# Altium project SYNCBOX_V3I1.PrjPcb (part 4 of 5)

## Sheet [07] - CPU CONNECTORS .SchDoc
size A2; Organization: Altium Limited; Address1: L3, 12a Rodborough Rd; Address2: Frenchs Forest; Address3: NSW; Address4: Australia 2086; DocumentNumber: 7; SheetNumber: 7; SheetTotal: 11
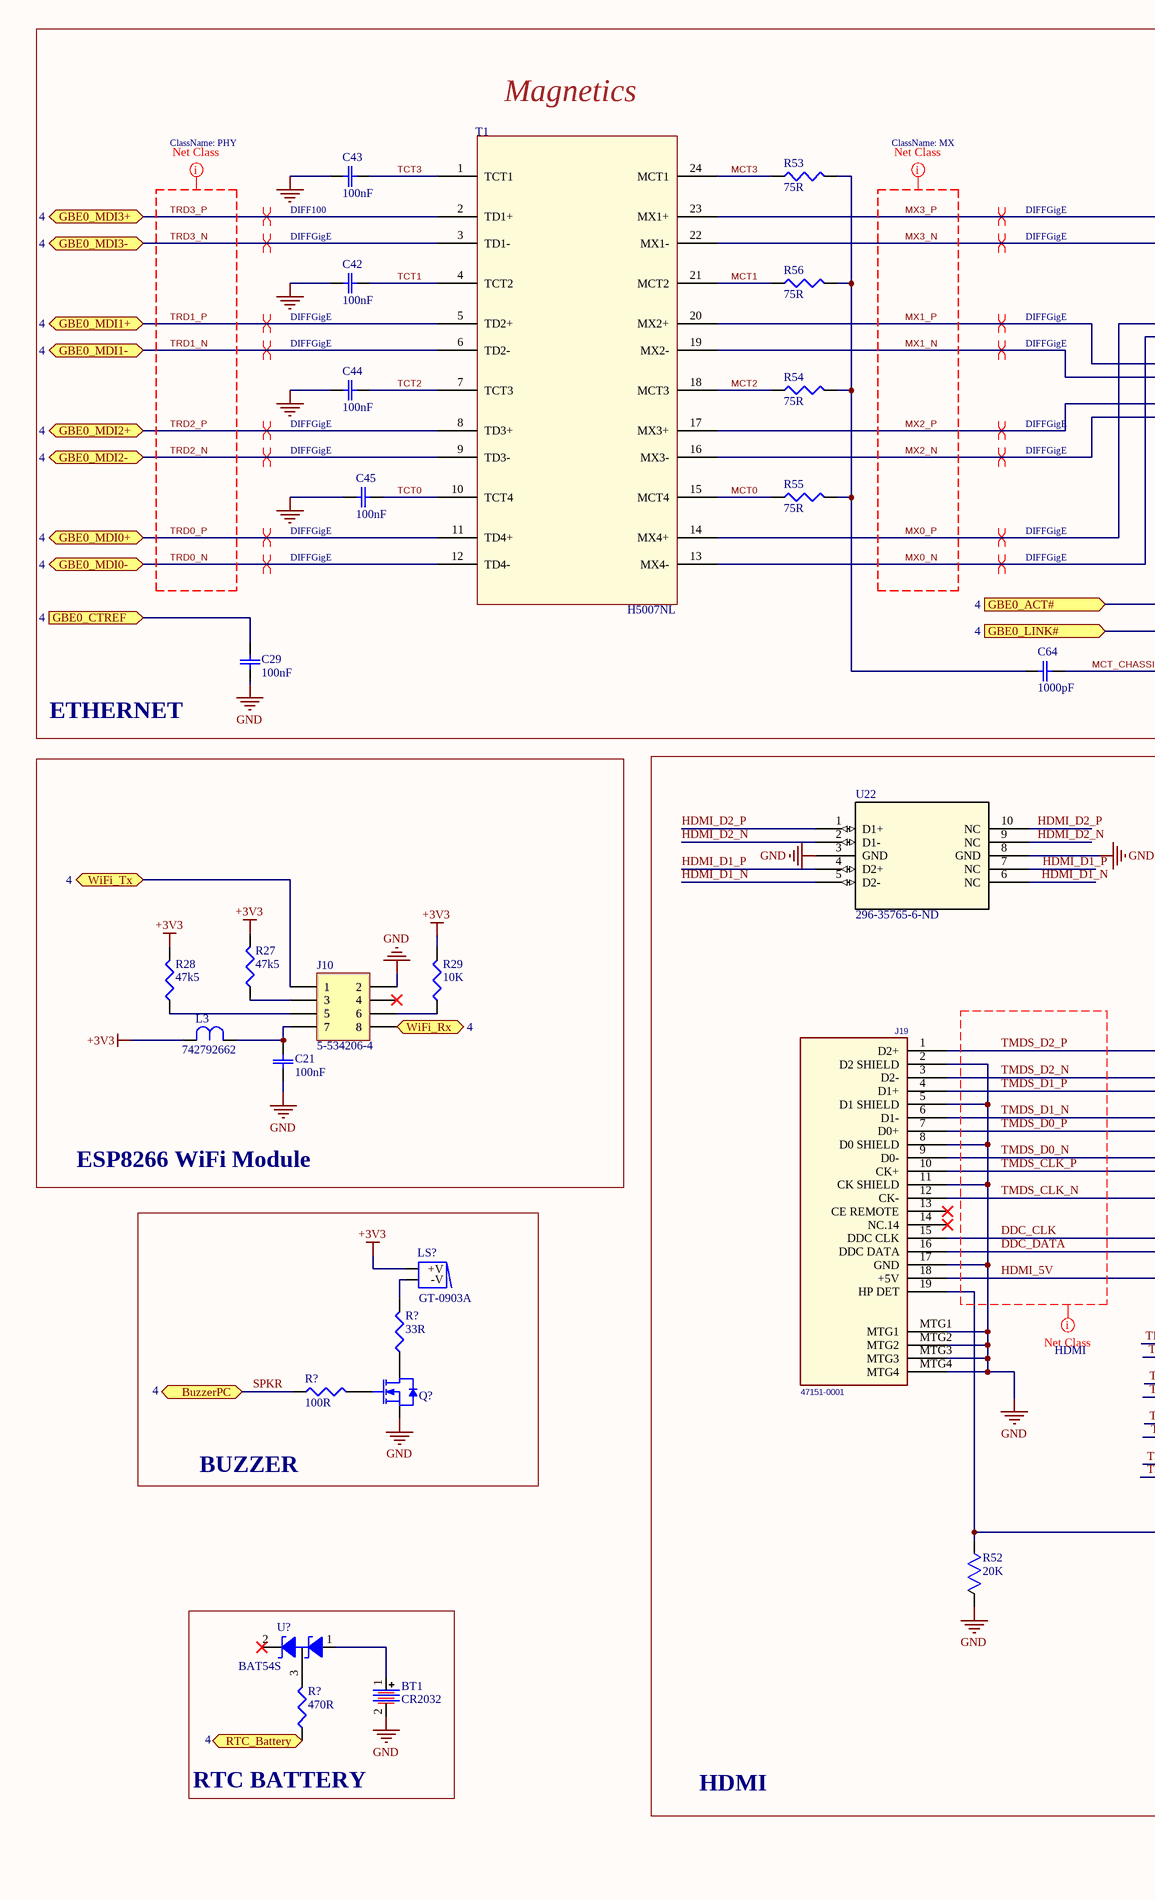
[diagram p10: [07] - CPU CONNECTORS .SchDoc, left]
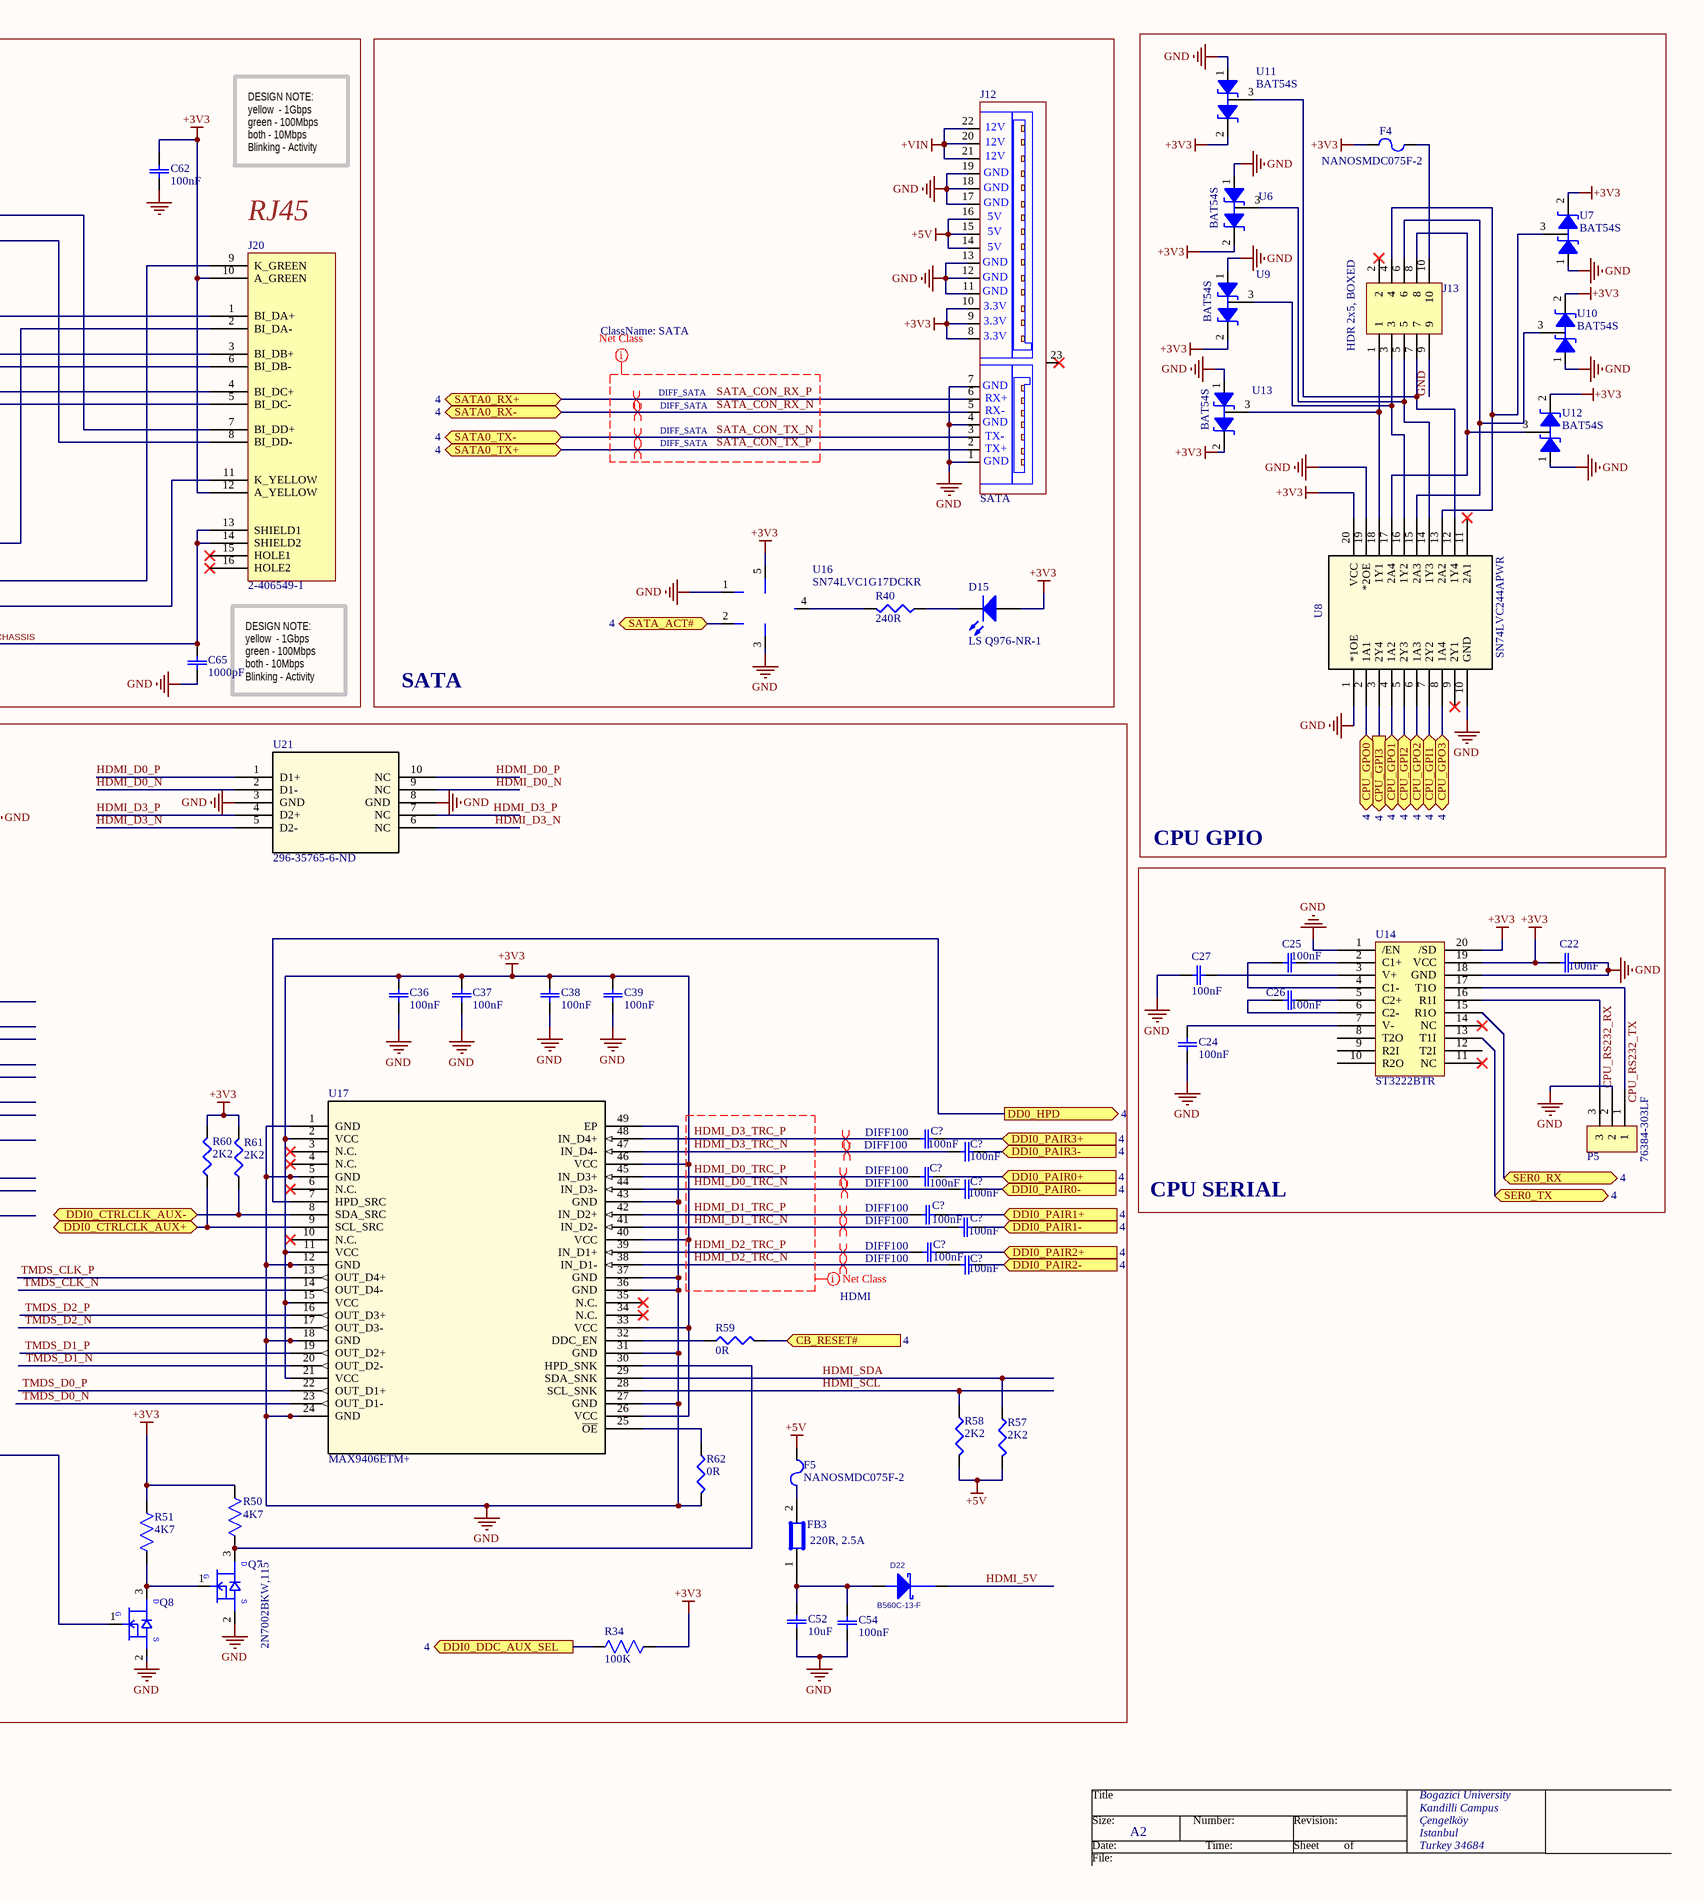
[diagram p11: [07] - CPU CONNECTORS .SchDoc, right]

### Parts
(Parts that share a designator on the sheet are numbered #1, #2 ... from top to bottom, then left to right.)
BT1  CR2032  [BS-7]
C21  100nF  [C0402]
C22  100nF  [C0402]
C24  100nF  [C0402]
C25  100nF  [C0402]
C26  100nF  [C0402]
C27  100nF  [C0402]
C29  100nF  [C0402]
C36  100nF  [C0402]
C37  100nF  [C0402]
C38  100nF  [C0402]
C39  100nF  [C0402]
C42  100nF  [C0402]
C43  100nF  [C0402]
C44  100nF  [C0402]
C45  100nF  [C0402]
C52  10uF  [CAP_3216]
C54  100nF  [C0402]
C62  100nF  [C0402]
C64  1000pF  [C1206]
C65  1000pF  [C1206]
C?#16  100nF  [CAP_1608]
C?#17  100nF  [CAP_1608]
C?#18  100nF  [CAP_1608]
C?#19  100nF  [CAP_1608]
C?#20  100nF  [CAP_1608]
C?#21  100nF  [CAP_1608]
C?#22  100nF  [CAP_1608]
C?#23  100nF  [CAP_1608]
D15  LS Q976-NR-1  [D0603_Directional]
D22  B560C-13-F  [SMC]
F4  NANOSMDC075F-2  [FUS_NANO_TYCO]
F5  NANOSMDC075F-2  [FUS_NANO_TYCO]
FB3  220R, 2.5A  [C0603]
J10  5-534206-4  [ESP8266_WSOC]
J12  SATA  [SATA_Recepticle]
J13  HDR 2x5, BOXED  [HDR_2X5_2.54MM_BOXED]
J19  47151-0001  [HDMI]
J20  2-406549-1  [RJ45LED]
L3  742792662  [IND_1608-M]
LS?  GT-0903A  [GT-0903A]
P5  76384-303LF  [HDR_1X3_2.54MM_SHDR_V2]
Q7  2N7002BKW,115  [SC70_SOT323]
Q8  2N7002BKW,115  [SC70_SOT323]  (value not drawn)
Q?  MOSFET N-CH 20V 1A SOT323  [SC70_SOT323]  (value not drawn)
R27  47k5  [R0402]
R28  47k5  [R0402]
R29  10K  [R0402]
R34  100K  [STA_RNCP0805-M]
R40  240R  [R0402]
R50  4K7  [RES0805_CRG_TYCO]
R51  4K7  [RES0805_CRG_TYCO]
R52  20K  [STA_RNCP0805]
R53  75R  [R0402]
R54  75R  [R0402]
R55  75R  [R0402]
R56  75R  [R0402]
R57  2K2  [R0402]
R58  2K2  [R0402]
R59  0R  [R0402]
R60  2K2  [R0402]
R61  2K2  [R0402]
R62  0R  [R0402]
R?#1  33R  [R0402]
R?#2  100R  [R0402]
R?#3  470R  [R0402]
T1  H5007NL  [H5007NL]
U6  BAT54S  [SOT-23]
U7  BAT54S  [SOT-23]
U8  SN74LVC244APWR  [PW20]
U9  BAT54S  [SOT-23]
U10  BAT54S  [SOT-23]
U11  BAT54S  [SOT-23]
U12  BAT54S  [SOT-23]
U13  BAT54S  [SOT-23]
U14  ST3222BTR  [TSSOP20]
U16  SN74LVC1G17DCKR  [DCK5]
U17  MAX9406ETM+  [21-0144H_T4877-6]
U21  296-35765-6-ND  [DQA10]
U22  296-35765-6-ND  [DQA10]
U?#4  BAT54S  [SOT-23]

### Blocks framed on the sheet
SATA: D15 J12 R40 U16
CPU GPIO: F4 J13 U6-U13
ESP8266 WiFi Module: C21 J10 L3 R27-R29
HDMI: C36-C39 C52 C54 C?#16-C?#23 D22 F5 FB3 J19 Q7 Q8 R34 R50-R52 R57-R62 U17 U21 U22
BUZZER: LS? Q? R?#1 R?#2
RTC BATTERY: BT1 R?#3 U?#4

### Ports
BuzzerPC (bidir, see 4), CB_RESET# (in, see 4), CPU_GPI1 (bidir, see 4), CPU_GPI2 (bidir, see 4), CPU_GPI3 (out, see 4), CPU_GPO0 (bidir, see 4), CPU_GPO1 (bidir, see 4), CPU_GPO2 (bidir, see 4), CPU_GPO3 (bidir, see 4), DD0_HPD (out, see 4), DDI0_CTRLCLK_AUX+ (bidir), DDI0_CTRLCLK_AUX- (bidir), DDI0_DDC_AUX_SEL (out, see 4), DDI0_PAIR0+ (in, see 4), DDI0_PAIR0- (in, see 4), DDI0_PAIR1+ (in, see 4), DDI0_PAIR1- (in, see 4), DDI0_PAIR2+ (in, see 4), DDI0_PAIR2- (in, see 4), DDI0_PAIR3+ (in, see 4), DDI0_PAIR3- (in, see 4), GBE0_ACT# (in, see 4), GBE0_CTREF (in, see 4), GBE0_LINK# (in, see 4), GBE0_MDI0+ (bidir, see 4), GBE0_MDI0- (bidir, see 4), GBE0_MDI1+ (bidir, see 4), GBE0_MDI1- (bidir, see 4), GBE0_MDI2+ (bidir, see 4), GBE0_MDI2- (bidir, see 4), GBE0_MDI3+ (bidir, see 4), GBE0_MDI3- (bidir, see 4), RTC_Battery (bidir, see 4), SATA0_RX+ (bidir, see 4), SATA0_RX- (bidir, see 4), SATA0_TX+ (bidir, see 4), SATA0_TX- (bidir, see 4), SATA_ACT# (bidir, see 4), SER0_RX (bidir, see 4), SER0_TX (bidir, see 4), WiFi_Rx (bidir, see 4), WiFi_Tx (bidir, see 4)

### Nets
+3V3: C22.2 C36.2 C37.2 C38.2 C39.2 C62.2 D15.1(A) F4.2 J12.8 J12.9 J12.10 J20.10(A_GREEN) J20.12(A_YELLOW) L3.2 LS?.1(+V) R27.2 R28.2 R29.2 R34.1 R50.1 R51.1 R60.2 R61.2 U6.2 U7.2 U8.20(VCC) U9.2 U10.2 U11.2 U12.2 U13.2 U14.19(VCC) U14.20(/SD) U16.5(VCC) U17.2(VCC) U17.11(VCC) U17.15(VCC) U17.21(VCC) U17.26(VCC) U17.33(VCC) U17.40(VCC) U17.46(VCC)  [project net PWR_OUT2]
+5V: F5.2 J12.14 J12.15 J12.16 R57.2 R58.2
+VIN: J12.20 J12.21 J12.22
GND: BT1.2 C21.1 C22.1 C24.1 C27.1 C29.1 C36.1 C37.1 C38.1 C39.1 C42.1 C43.1 C44.1 C45.1 C52.1 C54.1 C62.1 C65.2 J10.2 J12.1 J12.4 J12.7 J12.11 J12.12 J12.13 J12.17 J12.18 J12.19 J13.9 J19.2(D2_SHIELD) J19.5(D1_SHIELD) J19.8(D0_SHIELD) J19.11(CK_SHIELD) J19.17(GND) J19.MTG1 J19.MTG2 J19.MTG3 J19.MTG4 P5.2 Q7.2(SOURCE) Q8.2(SOURCE) Q?.2(S) R52.2 R62.2 U6.1 U7.1 U8.1(*1OE) U8.10(GND) U8.19(*2OE) U9.1 U10.1 U11.1 U12.1 U13.1 U14.1(/EN) U14.18(GND) U16.1(NC) U16.3(GND) U17.1(GND) U17.5(GND) U17.12(GND) U17.18(GND) U17.24(GND) U17.27(GND) U17.31(GND) U17.36(GND) U17.37(GND) U17.43(GND) U17.49(EP) U21.3(GND) U21.8(GND) U22.3(GND) U22.8(GND)
CPU_GPO0: U8.2(1A1) ; port CPU_GPO0
CPU_RS232_RX: P5.3 U14.16(R1I)
CPU_RS232_TX: P5.1 U14.17(T1O)
DDC_CLK: J19.15(DDC_CLK)
DDC_DATA: J19.16(DDC_DATA)
HDMI_5V: D22.1(cathode) J19.18(+5V)
HDMI_D0_N: U21.2(D1-) U21.9(NC)
HDMI_D0_P: U21.1(D1+) U21.10(NC)
HDMI_D0_TRC_N: C?#19.1 U17.44(IN_D3-)
HDMI_D0_TRC_P: C?#18.1 U17.45(IN_D3+)
HDMI_D1_N: U22.5(D2-) U22.6(NC)
HDMI_D1_P: U22.4(D2+) U22.7(NC)
HDMI_D1_TRC_N: C?#21.1 U17.41(IN_D2-)
HDMI_D1_TRC_P: C?#20.1 U17.42(IN_D2+)
HDMI_D2_N: U22.2(D1-) U22.9(NC)
HDMI_D2_P: U22.1(D1+) U22.10(NC)
HDMI_D2_TRC_N: C?#23.1 U17.38(IN_D1-)
HDMI_D2_TRC_P: C?#22.1 U17.39(IN_D1+)
HDMI_D3_N: U21.5(D2-) U21.6(NC)
HDMI_D3_P: U21.4(D2+) U21.7(NC)
HDMI_D3_TRC_N: C?#17.1 U17.47(IN_D4-)
HDMI_D3_TRC_P: C?#16.1 U17.48(IN_D4+)
HDMI_SCL: R58.1 U17.28(SCL_SNK)
HDMI_SDA: R57.1 U17.29(SDA_SNK)
MCT0: R55.1 T1.15(MCT4)
MCT1: R56.1 T1.21(MCT2)
MCT2: R54.1 T1.18(MCT3)
MCT3: R53.1 T1.24(MCT1)
MCT_CHASSIS: C64.1 C65.1 J20.13(SHIELD1) J20.14(SHIELD2)
MX0_N: J20.2(BI_DA-) T1.13(MX4-)
MX0_P: J20.1(BI_DA+) T1.14(MX4+)
MX1_N: J20.6(BI_DB-) T1.19(MX2-)
MX1_P: J20.3(BI_DB+) T1.20(MX2+)
MX2_N: J20.5(BI_DC-) T1.16(MX3-)
MX2_P: J20.4(BI_DC+) T1.17(MX3+)
MX3_N: J20.8(BI_DD-) T1.22(MX1-)
MX3_P: J20.7(BI_DD+) T1.23(MX1+)
SATA_CON_RX_N: J12.5 ; port SATA0_RX-
SATA_CON_RX_P: J12.6 ; port SATA0_RX+
SATA_CON_TX_N: J12.3 ; port SATA0_TX-
SATA_CON_TX_P: J12.2 ; port SATA0_TX+
SPKR: R?#2.1 ; port BuzzerPC
TCT0: C45.2 T1.10(TCT4)
TCT1: C42.2 T1.4(TCT2)
TCT2: C44.2 T1.7(TCT3)
TCT3: C43.2 T1.1(TCT1)
TMDS_CLK_N: J19.12(CK-) U17.14(OUT_D4-)
TMDS_CLK_P: J19.10(CK+) U17.13(OUT_D4+)
TMDS_D0_N: J19.9(D0-) U17.23(OUT_D1-)
TMDS_D0_P: J19.7(D0+) U17.22(OUT_D1+)
TMDS_D1_N: J19.6(D1-) U17.20(OUT_D2-)
TMDS_D1_P: J19.4(D1+) U17.19(OUT_D2+)
TMDS_D2_N: J19.3(D2-) U17.17(OUT_D3-)
TMDS_D2_P: J19.1(D2+) U17.16(OUT_D3+)
TRD0_N: T1.12(TD4-) ; port GBE0_MDI0-
TRD0_P: T1.11(TD4+) ; port GBE0_MDI0+
TRD1_N: T1.6(TD2-) ; port GBE0_MDI1-
TRD1_P: T1.5(TD2+) ; port GBE0_MDI1+
TRD2_N: T1.9(TD3-) ; port GBE0_MDI2-
TRD2_P: T1.8(TD3+) ; port GBE0_MDI2+
TRD3_N: T1.3(TD1-) ; port GBE0_MDI3-
TRD3_P: T1.2(TD1+) ; port GBE0_MDI3+
NetBT1_1: BT1.1 U?#4.1
NetC21_2: C21.2 J10.7 L3.1
NetC24_2: C24.2 U14.7(V-)
NetC25_1: C25.1 U14.2(C1+)
NetC25_2: C25.2 U14.4(C1-)
NetC26_1: C26.1 U14.5(C2+)
NetC26_2: C26.2 U14.6(C2-)
NetC27_2: C27.2 U14.3(V+)
NetC29_2: C29.2 ; port GBE0_CTREF
NetC52_2: C52.2 C54.2 D22.2(ANODE) FB3.1
NetC64_2: C64.2 R53.2 R54.2 R55.2 R56.2
NetC?#16_2: C?#16.2 ; port DDI0_PAIR3+
NetC?#17_2: C?#17.2 ; port DDI0_PAIR3-
NetC?#18_2: C?#18.2 ; port DDI0_PAIR0+
NetC?#19_2: C?#19.2 ; port DDI0_PAIR0-
NetC?#20_2: C?#20.2 ; port DDI0_PAIR1+
NetC?#21_2: C?#21.2 ; port DDI0_PAIR1-
NetC?#22_2: C?#22.2 ; port DDI0_PAIR2+
NetC?#23_2: C?#23.2 ; port DDI0_PAIR2-
NetD15_2: D15.2(K) R40.1
NetF4_1: F4.1 J13.10
NetF5_1: F5.1 FB3.2
NetJ8#1_A8: J20.11(K_YELLOW) ; port GBE0_LINK#
NetJ8#1_A28: U16.2(A) ; port SATA_ACT#
NetJ8#1_A63: U8.7(2Y2) ; port CPU_GPI1
NetJ8#1_A67: U8.5(2Y3) ; port CPU_GPI2
NetJ8#1_A85: U8.3(2Y4) ; port CPU_GPI3
NetJ8#1_B2: J20.9(K_GREEN) ; port GBE0_ACT#
NetJ8#1_B54: U8.4(1A2) ; port CPU_GPO1
NetJ8#1_B57: U8.6(1A3) ; port CPU_GPO2
NetJ8#1_B63: U8.8(1A4) ; port CPU_GPO3
NetJ8#1_B89: U17.7(HPD_SRC) ; port DD0_HPD
NetJ8#1_B95: R34.2 ; port DDI0_DDC_AUX_SEL
NetJ8#1_B98: R60.1 U17.9(SCL_SRC) ; port DDI0_CTRLCLK_AUX+
NetJ8#1_B99: R61.1 U17.8(SDA_SRC) ; port DDI0_CTRLCLK_AUX-
NetJ10_1: J10.1 ; port WiFi_Tx
NetJ10_3: J10.3 R27.1
NetJ10_5: J10.5 R28.1
NetJ10_6: J10.6 R29.1
NetJ10_8: J10.8 ; port WiFi_Rx
NetJ13_1: J13.1 U8.18(1Y1) U13.3
NetJ13_3: J13.3 U8.16(1Y2) U9.3
NetJ13_4: J13.4 U7.3 U8.13(2A2)
NetJ13_5: J13.5 U6.3 U8.14(1Y3)
NetJ13_6: J13.6 U8.15(2A3) U10.3
NetJ13_7: J13.7 U8.12(1Y4) U11.3
NetJ13_8: J13.8 U8.17(2A4) U12.3
NetJ19_19: J19.19(HP_DET) Q8.1(GATE) R52.1
NetJ?#1_2: U14.15(R1O) ; port SER0_RX
NetJ?#4_1: U14.13(T1I) ; port SER0_TX
NetLS?_2: LS?.2(-V) R?#1.2
NetQ7_1: Q7.1(GATE) Q8.3(DRAIN) R51.2
NetQ7_3: Q7.3(DRAIN) R50.2 U17.30(HPD_SNK)
NetQ?_1: Q?.1(G) R?#2.2
NetQ?_3: Q?.3(D) R?#1.1
NetR40_2: R40.2 U16.4(Y)
NetR59_1: R59.1 U17.32(DDC_EN)
NetR59_2: R59.2 ; port CB_RESET#
NetR62_1: R62.1 U17.25(~{OE})
NetR?#3_1: R?#3.1 ; port RTC_Battery
NetR?#3_2: R?#3.2 U?#4.3

Not connected (* = marked no-connect by the designer): J10 4*; J12 23*; J13 2*; J19 13(CE_REMOTE)* 14(NC.14)*; J20 15(HOLE1)* 16(HOLE2)*; U8 9(2Y1)* 11(2A1)*; U14 8(T2O) 9(R2I) 10(R2O) 11(NC)* 12(T2I) 14(NC)*; U17 3(N.C.)* 4(N.C.)* 6(N.C.)* 10(N.C.)* 34(N.C.)* 35(N.C.)*; U?#4 2*

### Layout directives
differential pair; net class DIFF100: HDMI_D0_TRC_N, HDMI_D0_TRC_P, HDMI_D1_TRC_N, HDMI_D1_TRC_P, HDMI_D2_TRC_N, HDMI_D2_TRC_P, HDMI_D3_TRC_N, HDMI_D3_TRC_P, TRD3_P
differential pair; net class DIFFGigE: MX0_N, MX0_P, MX1_N, MX1_P, MX2_N, MX2_P, MX3_N, MX3_P, TRD0_N, TRD0_P, TRD1_N, TRD1_P, TRD2_N, TRD2_P, TRD3_N
net class PHY: TRD0_N, TRD0_P, TRD1_N, TRD1_P, TRD2_N, TRD2_P, TRD3_N, TRD3_P
net class MX: MX0_N, MX0_P, MX1_N, MX1_P, MX2_N, MX2_P, MX3_N, MX3_P
differential pair; net class DIFF_SATA: SATA_CON_RX_N, SATA_CON_RX_P, SATA_CON_TX_N, SATA_CON_TX_P
net class SATA: SATA_CON_RX_N, SATA_CON_RX_P, SATA_CON_TX_N, SATA_CON_TX_P
net class HDMI: DDC_CLK, DDC_DATA, HDMI_5V, HDMI_D0_TRC_N, HDMI_D0_TRC_P, HDMI_D1_TRC_N, HDMI_D1_TRC_P, HDMI_D2_TRC_N, HDMI_D2_TRC_P, HDMI_D3_TRC_N, HDMI_D3_TRC_P, TMDS_CLK_N, TMDS_CLK_P, TMDS_D0_N, TMDS_D0_P, TMDS_D1_N, TMDS_D1_P, TMDS_D2_N, TMDS_D2_P

### Notes on the sheet
- Magnetics
- DESIGN NOTE:
  yellow  - 1Gbps
  green - 100Mbps
  both - 10Mbps
  Blinking - Activity
- (near J20) RJ45
- ETHERNET
- CPU SERIAL
- Title
- Bogazici University
- Size:
- Date:
- File:
- A2
- Number:
- Time:
- Revision:
- Sheet
- of
- Kandilli Campus
- Çengelköy
- Istanbul
- Turkey 34684
- (in symbol 2N7002BKW,115) D; G; S
- (in symbol SATA) 12V; GND; 5V; 3.3V; RX+; RX-; TX-; TX+

### Library data of the parts
BT1 = CR2032: BS-7-ND; Supplier 1: Electro Sonic; Supplier Part Number 1: BS7; Manufacturer Part Number: BS-7
C21 C29 C36-C39 C42-C45 C62 = CL05A104KA5NNNC: CAP CER 0.1UF 50V X8R 0603; Manufacturer 1: Samsung Electro-Mechanics; Tolerance: ±10%; Voltage - Rated: 25V; Temperature Coefficient: X5R; Notification: Current market demand for these product types have resulted in fluctuating and extending lead times. Lead times may differ.; Description 1: CAP CER 0.1UF 25V X5R 0402; Manufacturer Part Number 1: CL05A104KA5NNNC; RoHS: RoHS Compliant; Stock 1: 100000; Pricing 1: 1=0.1, 10=0.04, 100=0.0176, 500=0.0126, 1000=0.0099, 2500=0.009, 5000=0.00828 (USD); Packaging: Digi-Reel®; Part Status: Active; Operating Temperature: -55°C ~ 85°C; Features: -; Ratings: -; Applications: General Purpose; Mounting Type: Surface Mount, MLCC; Package / Case: 0402 (1005 Metric); Size / Dimension: 0.039" L x 0.020" W (1.00mm x 0.50mm); Height - Seated (Max): -; Thickness (Max): 0.022" (0.55mm); Lead Spacing: -; Lead Style: -; Supplier 1: Digi-Key; Supplier Part Number 1: 1276-1043-6-ND; Category: Capacitors; ComponentLink1URL: http://www.samsungsem.com/kr/support/product-search/mlcc/CL05A104KA5NNNC.jsp; ComponentLink1Description: http://www.samsungsem.com/kr/support/product-search/mlcc/CL05A104KA5NNNC.jsp
C22 C24-C27 C54 = CL05A104KA5NNNC: CAP CER 0.1UF 50V X8R 0603; Manufacturer 1: Samsung Electro-Mechanics; Voltage - Rated: 25V; Tolerance: ±10%; Temperature Coefficient: X5R; Notification: Current market demand for these product types have resulted in fluctuating and extending lead times. Lead times may differ.; Description 1: CAP CER 0.1UF 25V X5R 0402; Category: Capacitors; Operating Temperature: -55°C ~ 85°C; Package / Case: 0402 (1005 Metric); Supplier 1: Digi-Key; Supplier Part Number 1: 1276-1043-6-ND; RoHS: RoHS Compliant; Stock 1: 100000; Pricing 1: 1=0.1, 10=0.04, 100=0.0176, 500=0.0126, 1000=0.0099, 2500=0.009, 5000=0.00828 (USD); Mounting Type: Surface Mount, MLCC; Applications: General Purpose; Ratings: -; Size / Dimension: 0.039" L x 0.020" W (1.00mm x 0.50mm); Height - Seated (Max): -; Thickness (Max): 0.022" (0.55mm); Lead Spacing: -; Features: -; Packaging: Digi-Reel®; Lead Style: -; ComponentLink1URL: http://www.samsungsem.com/kr/support/product-search/mlcc/CL05A104KA5NNNC.jsp; ComponentLink1Description: http://www.samsungsem.com/kr/support/product-search/mlcc/CL05A104KA5NNNC.jsp; Manufacturer Part Number 1: CL05A104KA5NNNC; Part Status: Active
C52 = C3216JB1V106K160: CAP CER 10UF 35V JB 1206; Manufacturer_Part_Number: C3216JB1V106K160AB; Manufacturer 1: TDK Corporation; Tolerance: ±10%; Vendor: TDK; Built_By: EMA_UL_Team; Type: DEV; C: Copyright (C) 2015 Accelerated Designs. All rights reserved; Notification: Current market demand for these product types have resulted in fluctuating and extending lead times. Lead times may differ.; Category: Capacitors; Operating Temperature: -25°C ~ 85°C; Package / Case: 1206 (3216 Metric); Value: Value; Voltage - Rated: 35V; Features: Low ESL; Supplier 1: Digi-Key; Supplier Part Number 1: 445-11736-1-ND; RoHS: RoHS Compliant; Stock 1: 5285; Pricing 1: 1=0.92, 10=0.648, 100=0.4269, 500=0.31626, 1000=0.26881 (USD); Temperature Coefficient: JB; Mounting Type: Surface Mount, MLCC; Applications: General Purpose; Ratings: -; Size / Dimension: 0.126" L x 0.063" W (3.20mm x 1.60mm); Height - Seated (Max): -; Thickness (Max): 0.069" (1.75mm); Lead Spacing: -; Packaging: Cut Tape (CT); Lead Style: -; ComponentLink1URL: https://product.tdk.com/info/en/catalog/datasheets/mlcc_commercial_general_en.pdf; ComponentLink1Description: https://product.tdk.com/info/en/catalog/datasheets/mlcc_commercial_general_en.pdf; RefDes: RefDes; Manufacturer Part Number 1: C3216JB1V106K160AB; Part Status: Active; Failure Rate: -; Description 1: CAP CER 10UF 35V JB 1206
C64 C65 = C1206X102KGRACAUTO: CAP CER 1206 1NF 2000V X7R 10% F; Manufacturer 1: KEMET; Voltage - Rated: 2000V (2kV); Category: Capacitors; Operating Temperature: -55°C ~ 125°C; Package / Case: 1206 (3216 Metric); Supplier 1: Digi-Key; Supplier Part Number 1: 399-16730-1-ND; RoHS: RoHS Compliant; Stock 1: 7503; Pricing 1: 1=0.79, 10=0.58, 100=0.3974, 500=0.31464, 1000=0.26496 (USD); Tolerance: ±10%; Temperature Coefficient: X7R; Mounting Type: Surface Mount, MLCC; Applications: Automotive, Boardflex Sensitive; Ratings: AEC-Q200; Size / Dimension: 0.130" L x 0.063" W (3.30mm x 1.60mm); Height - Seated (Max): -; Thickness (Max): 0.073" (1.85mm); Lead Spacing: -; Features: Low ESL, Soft Termination, High Voltage; Packaging: Cut Tape (CT); Lead Style: -; ComponentLink1URL: https://api.kemet.com/component-edge/download/datasheet/C1206X102KGRACAUTO.pdf; ComponentLink1Description: https://api.kemet.com/component-edge/download/datasheet/C1206X102KGRACAUTO.pdf; Manufacturer Part Number 1: C1206X102KGRACAUTO; Part Status: Active; Failure Rate: -; Description 1: CAP CER 1206 1NF 2000V X7R 10% F
C?#16-C?#23 = C1608X8R1H104K08: CAP CER 0.1UF 50V X8R 0603; Manufacturer_Part_Number: C1608X8R1H104K080AB; Manufacturer 1: TDK Corporation; Vendor: TDK; Built_By: EMA_UL_Team; Type: DEV; C: Copyright (C) 2015 Accelerated Designs. All rights reserved; Tolerance: ±10%; Notification: Current market demand for these product types have resulted in fluctuating and extending lead times. Lead times may differ.; .Checked PCB: CHK; RefDes: RefDes; Value: Value; Manufacturer Part Number 1: C1608X8R1H104K080AB; RoHS: RoHS Compliant; Stock 1: 5228; Pricing 1: 1=0.32, 10=0.216, 100=0.1093, 500=0.07476, 1000=0.06613 (USD); Packaging: Cut Tape (CT); Part Status: Active; Voltage - Rated: 50V; Temperature Coefficient: X8R; Operating Temperature: -55°C ~ 150°C; Features: High Temperature; Ratings: -; Applications: General Purpose; Failure Rate: -; Mounting Type: Surface Mount, MLCC; Package / Case: 0603 (1608 Metric); Size / Dimension: 0.063" L x 0.032" W (1.60mm x 0.80mm); Height - Seated (Max): -; Thickness (Max): 0.035" (0.90mm); Lead Spacing: -; Lead Style: -; Supplier 1: Digi-Key; Supplier Part Number 1: 445-8818-1-ND; Description 1: CAP CER 0.1UF 50V X8R 0603; Category: Capacitors; .Checked SCH: CHK
D15 = LS Q976-NR-1: LED RED DIFFUSED 0603 SMD; Manufacturer 1: OSRAM Opto Semiconductors Inc.; Lens Color: White; Millicandela Rating: 104mcd; Lens Style/Size: Rectangle with Flat Top, 1.00mm x 0.80mm; Voltage - Forward (Vf) (Typ): 2V; Current - Test: 20mA; Viewing Angle: 160°; Wavelength - Dominant: 633nm; Wavelength - Peak: 645nm; Published: 8-Jun-2000; LatestRevisionDate: 08-Jul-2005; LatestRevisionNote: Mech Layer 1 removed.; PackageReference: LED-0; Publisher: Altium Limited; PackageDescription: LED; 2 Leads; Supplier 1: Digi-Key; Supplier Part Number 1: 475-2512-1-ND; Manufacturer Part Number 1: LS Q976-NR-1; RoHS: RoHS Compliant; Description 1: LED RED DIFFUSED 0603 SMD; Category: Optoelectronics; Stock 1: 127302; Pricing 1: 1=0.38, 10=0.274, 25=0.202, 100=0.1444, 250=0.0982, 500=0.08664, 1000=0.06787 (USD); Packaging: Cut Tape (CT); Part Status: Active; Color: Red; Lens Transparency: Diffused; Mounting Type: Surface Mount; Features: -; Package / Case: 0603 (1608 Metric); Supplier Device Package: 0603; Size / Dimension: 1.60mm L x 0.80mm W; Height (Max): 0.80mm; ComponentLink1URL: https://dammedia.osram.info/media/resource/hires/osram-dam-2493499/LS%20Q976.pdf; ComponentLink1Description: https://dammedia.osram.info/media/resource/hires/osram-dam-2493499/LS%20Q976.pdf
D22 = B560C-13-F: DIODE SCHOTTKY 60V 5A SMC; Manufacturer: Diodes Inc; .Checked PCB: used; Voltage - Forward (Vf) (Max) @ If: 700mV @ 5A; Speed: Fast Recovery =< 500ns, > 200mA (Io); Current - Reverse Leakage @ Vr: 500µA @ 60V; Capacitance @ Vr, F: 300pF @ 4V, 1MHz; .Checked SCH: used; Category: Discrete Semiconductor Products; Supplier Part Number: B560C-FDICT-ND; Manufacturer Part Number: B560C-13-F; Price 1k [$]: 0.42900; Value: B560C-13-F; Package / Case: DO-214AB, SMC; Supplier: Digikey; Family: Diodes, Rectifiers - Single; Voltage - DC Reverse (Vr) (Max): 60V; Current - Average Rectified (Io): 5A; Diode Type: Schottky; Supplier 1: Digi-Key; Supplier Part Number 1: B560C-FDICT-ND; RoHS: RoHS Compliant; Stock 1: 37770; Pricing 1: 1=0.99, 10=0.884, 100=0.702, 250=0.611, 500=0.546, 1000=0.429 (USD); Reverse Recovery Time (trr): -; Mounting Type: Surface Mount; Supplier Device Package: SMC; Packaging: Cut Tape (CT); ComponentLink1URL: http://www.diodes.com/datasheets/ds13012.pdf; ComponentLink1Description: http://www.diodes.com/datasheets/ds13012.pdf
F4 F5 = NANOSMDC075F-2: PTC RESET FUSE 6V 750MA 1206; Manufacturer 1: Littelfuse Inc.; Vendor: TE Connectivity; Built_By: EMA_UL_Team; Type: DEV; C: Copyright (C) 2015 Accelerated Designs. All rights reserved; Approvals: CSA, TUV, UL; .Checked PCB: CHK; Manufacturer_Part_Number: NANOSMDC075F-2; RefDes: RefDes; Value: Value; Manufacturer Part Number 1: NANOSMDC075F-2; RoHS: RoHS Compliant; Stock 1: 13379; Pricing 1: 1=0.54, 5=0.528, 10=0.512, 50=0.4306, 100=0.3575, 250=0.325, 500=0.27626, 1000=0.24375 (USD); Packaging: Cut Tape (CT); Part Status: Active; Voltage - Max: 6V; Operating Temperature: -40°C ~ 85°C; Ratings: -; Mounting Type: Surface Mount; Package / Case: 1206 (3216 Metric), Concave; Size / Dimension: 0.126" L x 0.063" W (3.20mm x 1.59mm); Height - Seated (Max): -; Thickness (Max): 0.027" (0.68mm); Lead Spacing: -; ComponentLink1URL: http://www.littelfuse.com/~/media/electronics/product_specifications/resettable_ptcs/littelfuse_ptc_nanosmdc075f_2_product_specification.pdf.pdf; ComponentLink1Description: http://www.littelfuse.com/~/media/electronics/product_specifications/resettable_ptcs/littelfuse_ptc_nanosmdc075f_2_product_specification.pdf.pdf; Supplier 1: Digi-Key; Supplier Part Number 1: NANOSMDC075F-2CT-ND; Description 1: PTC RESET FUSE 6V 750MA 1206; Category: Circuit Protection; .Checked SCH: CHK
FB3 = BLM18SG221TN1D: FERRITE CHIP 220 OHM 2500MA 0603; Manufacturer: Murata Electronics North America; Impedance @ Frequency: 220 Ohm @ 100MHz; DC Resistance (DCR): 40 mOhm Max; Filter Type: Differential Mode - Single; Number of Lines: 1; .Checked PCB: RF; Supplier 1: Digi-Key; Supplier Part Number 1: 490-5225-1-ND; Manufacturer Part Number: BLM18SG221TN1D; RoHS: RoHS Compliant; Category: Filters; Stock 1: 54640; Pricing 1: 1=0.38, 10=0.282, 50=0.1646, 100=0.1316, 250=0.094, 500=0.06392, 1000=0.0517, 5000=0.04042 (USD); Current Rating: 2.5A; Package / Case: 0603 (1608 Metric); Mounting Type: Surface Mount; Packaging: Cut Tape (CT); Height (Max): 0.037" (0.95mm); Size / Dimension: 0.063" L x 0.031" W (1.60mm x 0.80mm); ComponentLink1URL: http://search.murata.co.jp/Ceramy/image/img/PDF/ENG/L0110S0100BLM18S.pdf; ComponentLink1Description: http://search.murata.co.jp/Ceramy/image/img/PDF/ENG/L0110S0100BLM18S.pdf; .Checked SCH: RF
J10 = 5-534206-4: CONN RECEPT 8POS .100 VERT DUAL; Manufacturer 1: TE Connectivity AMP Connectors; Connector Type: Receptacle; Style: Board to Board or Cable; Number of Positions: 8; Number of Positions Loaded: All; Pitch - Mating: 0.100" (2.54mm); Contact Length - Post: 0.115" (2.92mm); Material Flammability Rating: UL94 V-0; Current Rating: 2A; LatestRevisionDate: 17-Jul-2002; LatestRevisionNote: Re-released for DXP Platform.; Publisher: Altium Limited; Supplier 1: Digi-Key; Supplier Part Number 1: A32935-ND; Manufacturer Part Number 1: 5-534206-4; RoHS: RoHS Compliant; Description 1: CONN RECEPT 8POS .100 VERT DUAL; Category: Connectors, Interconnects; Stock 1: 2281; Pricing 1: 1=1.92, 10=1.74, 100=1.491, 500=1.2425, 1000=1.065, 5000=0.9443, 10000=0.923 (USD); Packaging: Tube; Part Status: Active; Contact Type: Female Socket; Row Spacing - Mating: 0.100" (2.54mm); Mounting Type: Through Hole; Termination: Solder; Fastening Type: Push-Pull; Contact Finish - Mating: Gold; Contact Finish Thickness - Mating: 30.0µin (0.76µm); Insulation Color: Black; Insulation Height: 0.320" (8.13mm); Operating Temperature: -65°C ~ 125°C; Contact Finish - Post: Tin; Mated Stacking Heights: -; Ingress Protection: -; Features: -; Voltage Rating: -; Applications: -; Insulation Material: Polyester, Glass Filled; Contact Shape: Square; Contact Material: Phosphor Bronze; Contact Finish Thickness - Post: 150.0µin (3.81µm); ComponentLink1URL: http://www.te.com/commerce/DocumentDelivery/DDEController?Action=srchrtrv&DocNm=534206&DocType=Customer+Drawing&DocLang=English; ComponentLink1Description: http://www.te.com/commerce/DocumentDelivery/DDEController?Action=srchrtrv&DocNm=534206&DocType=Customer+Drawing&DocLang=English
J12 = SATA: CONN SATA RECEPT 22POS SMD R/A; Manufacturer 1: Molex, LLC; Manufacturer Part Number 1: 0470182000; Connector Style: Receptacle; Number of Positions: 22; .Checked PCB: CHK; RoHS: RoHS Compliant; Stock 1: 2490; Pricing 1: 1=6.29, 10=6.028, 25=5.5036, 50=5.2414, 100=4.9793, 250=4.4552, 500=4.19312, 1000=3.66898, 2500=3.48553 (USD); Packaging: Tray; Part Status: Active; Connector Type: SATA; Mounting Type: Surface Mount, Right Angle; Termination: Solder; Features: Board Lock; Contact Finish: Gold; Contact Finish Thickness: Flash; ComponentLink1URL: https://www.molex.com/pdm_docs/sd/470182000_sd.pdf; ComponentLink1Description: https://www.molex.com/pdm_docs/sd/470182000_sd.pdf; Supplier 1: Digi-Key; Supplier Part Number 1: WM4050-ND; Description 1: CONN SATA RECEPT 22POS SMD R/A; Category: Connectors, Interconnects; .Checked SCH: CHK
J13 = D2510-6002-AR: CONN HEADER 10POS VERT 10GOLD; Manufacturer: 3M; Connector Type: Header, Shrouded; Number of Positions: 10; Number of Positions Loaded: All; Pitch: 0.100" (2.54mm); .Creator: MM; Supplier 1: Digi-Key; Manufacturer Part Number: D2510-6002-AR; RoHS: RoHS Compliant; Category: Connectors, Interconnects; Stock 1: 1080; Pricing 1: 1=1.57, 10=1.421, 50=1.276, 100=1.218, 250=1.102, 500=1.015, 1000=0.87, 2500=0.812, 5000=0.7714 (USD); Packaging: Bulk; Contact Type: Male Pin; Number of Rows: 2; Row Spacing: 0.100" (2.54mm); Contact Mating Length: 0.243" (6.17mm); Mounting Type: Through Hole; Termination: Solder; Fastening Type: -; Features: -; Contact Finish: Gold; Contact Finish Thickness: 10µin (0.25µm); Color: Black; ComponentLink1URL: http://multimedia.3m.com/mws/mediawebserver?66666UuZjcFSLXTtm8T_oxMcEVuQEcuZgVs6EVs6E666666--; ComponentLink1Description: http://multimedia.3m.com/mws/mediawebserver?66666UuZjcFSLXTtm8T_oxMcEVuQEcuZgVs6EVs6E666666--; Supplier Part Number 1: MHC10E-ND; .Checked PCB: MM; .Checked SCH: MM
J19 = 47151-0001: CONN RCPT 19POS HDMI RT ANG SMD; Manufacturer: Molex Connector Corporation; .Checked PCB: used; Number of Positions: 19; Pitch: 0.50mm (.020"); Gender: Receptacle; .Checked SCH: used; Category: Connectors, Interconnects; Connector Type: HDMI; Family: USB, IEEE-1394 (Firewire), DVI, HDMI; Manufacturer Part Number: 47151-0001; Operating Temperature: -20°C to +85°C; Price 1k [$]: 1.74610; Supplier: Digikey; Supplier Part Number: WM19086CT-ND; Value: 47151-0001; Supplier 1: Digi-Key; Supplier Part Number 1: WM19086CT-ND; RoHS: RoHS Compliant; Stock 1: 2756; Pricing 1: 1=3.1, 10=2.57, 50=2.1456, 100=1.9034 (USD); Number of Contacts: 19; Specifications: -; Mounting Type: Surface Mount, Right Angle, Horizontal; Features: Detent Lock; Packaging: Cut Tape (CT); Ingress Protection: -; ComponentLink1URL: http://www.molex.com/pdm_docs/sd/471510001_sd.pdf; ComponentLink1Description: http://www.molex.com/pdm_docs/sd/471510001_sd.pdf
J20 = 2-406549-1: CONN MOD JACK 8POS R/A G-Y PCB; Manufacturer: Tyco; Number of Positions: 8p8c (RJ45, Ethernet); Number of Ports: 1; Shielding: Shielded, EMI Finger; Ratings: Cat5; LED Color: Yellow - Green; Tab Direction: Up; Category: Connectors, Interconnects; Connector Type: Jack; Manufacturer Part Number: 2-406549-1; Price 1k [$]: 1.73278; Supplier: Digikey; Supplier Part Number: A97715-ND; Value: 2-406549-1; Supplier 1: Digi-Key; Supplier Part Number 1: A97715-ND; RoHS: RoHS Compliant; Stock 1: 9021; Pricing 1: 1=3.42 (USD); Number of Positions/Contacts: 8p8c (RJ45, Ethernet); Number of Rows: 1; Mounting Type: Through Hole; Orientation: 90° Angle (Right); Termination: Solder; Features: Board Lock; Packaging: Tray; Housing Material: Thermoplastic; Contact Material: Phosphor Bronze; Contact Finish: Gold; Operating Temperature: -40°C ~ 85°C; ComponentLink1URL: http://documents.tycoelectronics.com/commerce/DocumentDelivery/DDEController?Action=srchrtrv&DocNm=406549&DocType=CD&DocLang=EN; ComponentLink1Description: http://documents.tycoelectronics.com/commerce/DocumentDelivery/DDEController?Action=srchrtrv&DocNm=406549&DocType=CD&DocLang=EN
L3 = 742792662: FERRITE BEAD 1 KOHM 0603 1LN; Manufacturer 1: Wurth Electronics Inc.; Filter Type: Signal Line; Current Rating (Max): 600mA; DC Resistance (DCR) (Max): 300 mOhm; Supplier 1: Digi-Key; Supplier Part Number 1: 732-4670-2-ND; Manufacturer Part Number 1: 742792662; RoHS: RoHS Compliant; Description 1: FERRITE BEAD 1 KOHM 0603 1LN; Category: Filters; Stock 1: 40000; Pricing 1: 4000=0.095 (USD); Packaging: Tape & Reel (TR); Part Status: Active; Ratings: -; Operating Temperature: -55°C ~ 125°C; Package / Case: 0603 (1608 Metric); Mounting Type: Surface Mount; Height (Max): 0.039" (1.00mm); Size / Dimension: 0.063" L x 0.032" W (1.60mm x 0.80mm); ComponentLink1URL: http://katalog.we-online.de/pbs/datasheet/742792662.pdf; ComponentLink1Description: http://katalog.we-online.de/pbs/datasheet/742792662.pdf
LS? = GT-0903A: AUDIO MAGNETIC XDCR 2-4V TH; Manufacturer 1: Soberton Inc.; Driver Circuitry: Transducer, Externally Driven; Input Type: Zero-Peak Signal; Voltage Range: 2 ~ 4V; Frequency: 2.73kHz; Operating Mode: Single Tone; Sound Pressure Level (SPL): 85dB @ 3V, 10cm; Current - Supply: 80mA; Port Location: Top; Supplier 1: Digi-Key; Supplier Part Number 1: 433-1032-ND; Manufacturer Part Number 1: GT-0903A; RoHS: RoHS Compliant; Description 1: AUDIO MAGNETIC XDCR 2-4V TH; Category: Audio Products; Stock 1: 13944; Pricing 1: 1=0.97, 10=0.774, 25=0.7036, 50=0.658, 100=0.6125, 250=0.56, 500=0.5215, 1000=0.4865, 5000=0.4375 (USD); Packaging: Tray; Part Status: Active; Technology: Magnetic; Duration: -; Operating Temperature: -20°C ~ 60°C; Approvals: -; Ratings: -; Mounting Type: Through Hole; Termination: PC Pins; Size / Dimension: 0.354" Dia (9.00mm); Height - Seated (Max): 0.197" (5.00mm); ComponentLink1URL: http://cirlw3yrzg4afc1x47lv2k18.wpengine.netdna-cdn.com/wp-content/uploads/2016/10/GT-0903A-Rev.A_2016-1.pdf; ComponentLink1Description: http://cirlw3yrzg4afc1x47lv2k18.wpengine.netdna-cdn.com/wp-content/uploads/2016/10/GT-0903A-Rev.A_2016-1.pdf
P5 = 76384-303LF: CONN HEADER 3POS .100" STR GOLD; Manufacturer: FCI; Connector Type: Header, Shrouded; Number of Positions: 3; Number of Positions Loaded: All; Pitch: 0.100" (2.54mm); .Creator: MM; Supplier 1: Digi-Key; Manufacturer Part Number: 76384-303LF; RoHS: RoHS Compliant; Category: Connectors, Interconnects; Stock 1: 1441; Pricing 1: 1=0.59, 10=0.556, 25=0.5, 50=0.4444, 100=0.426, 250=0.38892, 500=0.3704, 1000=0.30558, 2500=0.2778 (USD); Packaging: Tube; Contact Type: Male Pin; Number of Rows: 1; Row Spacing: -; Contact Mating Length: 0.197" (5.00mm); Mounting Type: Through Hole; Termination: Solder; Fastening Type: Friction Lock; Features: -; Contact Finish: Gold, GXT™; Contact Finish Thickness: 30µin (0.76µm); Color: Black; ComponentLink1URL: http://portal.fciconnect.com/Comergent//fci/drawing/76384.pdf; ComponentLink1Description: http://portal.fciconnect.com/Comergent//fci/drawing/76384.pdf; Supplier Part Number 1: 609-1305-ND; .Checked PCB: MM; .Checked SCH: MM
Q7 Q8 = 2N7002BKW,115: MOSFET N-CH 60V 310MA SOT323; Manufacturer: NXP Semiconductors; FET Type: MOSFET N-Channel, Metal Oxide; FET Feature: Logic Level Gate; Rds On (Max) @ Id, Vgs: 1.6 Ohm @ 500mA, 10V; Vgs(th) (Max) @ Id: 2.1V @ 250µA; Gate Charge (Qg) @ Vgs: 0.6nC @ 4.5V; Input Capacitance (Ciss) @ Vds: 50pF @ 10V; Power - Max: 275mW; .Checked PCB: RF; Supplier 1: Digi-Key; Supplier Part Number 1: 568-5980-1-ND; Manufacturer Part Number: 2N7002BKW,115; RoHS: RoHS Compliant; Category: Discrete Semiconductor Products; Stock 1: 15666; Pricing 1: 1=0.39, 10=0.354, 25=0.2548, 100=0.1983, 250=0.12456, 500=0.10616, 1000=0.07233 (USD); Drain to Source Voltage (Vdss): 60V; Current - Continuous Drain (Id) @ 25° C: 310mA; Mounting Type: Surface Mount; Package / Case: SC-70, SOT-323; Supplier Device Package: SC-70; Packaging: Cut Tape (CT); ComponentLink1URL: http://www.nxp.com/documents/data_sheet/2N7002BKW.pdf; ComponentLink1Description: http://www.nxp.com/documents/data_sheet/2N7002BKW.pdf; .Checked SCH: RF
Q? = DMG1012UW-7: Manufacturer 1: Diodes Incorporated; Note: Pin 2 is electrically connected to pin 4.; FET Type: N-Channel; Current - Continuous Drain (Id) @ 25°C: 1A (Ta); Drive Voltage (Max Rds On,  Min Rds On): 1.8V, 4.5V; Rds On (Max) @ Id, Vgs: 450 mOhm @ 600mA, 4.5V; Vgs(th) (Max) @ Id: 1V @ 250µA; Vgs (Max): ±6V; Power Dissipation (Max): 290mW (Ta); Published: 8-Jun-2000; LatestRevisionDate: 17-Jul-2002; LatestRevisionNote: Re-released for DXP Platform.; DatasheetVersion: PD-9.814; PackageReference: TO-220AB; Publisher: Altium Limited; Code_JEDEC: TO-220-AB; ComponentLink1Description: Manufacturer Link; ComponentLink1URL: http://www.irf.com/; Digikey P/N: DMG1012UW-7DITR-ND; Supplier 1: Digi-Key; Supplier Part Number 1: DMG1012UW-7DICT-ND; Manufacturer Part Number 1: DMG1012UW-7; RoHS: RoHS Compliant; Description 1: MOSFET N-CH 20V 1A SOT323; Category: Discrete Semiconductor Products; Stock 1: 211076; Pricing 1: 1=0.41, 10=0.37, 100=0.2074, 500=0.1111, 1000=0.07554 (USD); Packaging: Cut Tape (CT); Part Status: Active; Technology: MOSFET (Metal Oxide); FET Feature: -; Operating Temperature: -55°C ~ 150°C (TJ); Mounting Type: Surface Mount; Supplier Device Package: SOT-323; Package / Case: SC-70, SOT-323; ComponentLink2URL: https://www.diodes.com/assets/Datasheets/ds31859.pdf; ComponentLink2Description: https://www.diodes.com/assets/Datasheets/ds31859.pdf
R27 R28 = RC0402FR-0747K5L: RES 47.5K OHM 1/16W 1% 0402 SMD; Manufacturer: Yageo; Power (Watts): 0.063W, 1/16W; Temperature Coefficient: ±100ppm/°C; .Checked PCB: RF; Supplier 1: Digi-Key; Supplier Part Number 1: 311-47.5KLRCT-ND; Manufacturer Part Number: RC0402FR-0747K5L; RoHS: RoHS Compliant; Category: Resistors; Stock 1: 59607; Pricing 1: 10=0.014, 100=0.0063, 500=0.00382, 1000=0.0027, 5000=0.00203 (USD); Resistance (Ohms): 47.5K; Composition: Thick Film; Features: -; Tolerance: ±1%; Package / Case: 0402 (1005 Metric); Size / Dimension: 0.039" L x 0.020" W (1.00mm x 0.50mm); Height: 0.016" (0.40mm); Number of Terminations: 2; Packaging: Cut Tape (CT); ComponentLink1URL: http://www.yageo.com/documents/recent/PYu-RC0402_51_RoHS_L_6.pdf; ComponentLink1Description: http://www.yageo.com/documents/recent/PYu-RC0402_51_RoHS_L_6.pdf; .Checked SCH: RF
R29 = RC1005F103CS: RES SMD 10K OHM 1% 1/16W 0402; Manufacturer 1: Samsung Electro-Mechanics; Power (Watts): 0.063W, 1/16W; .Checked PCB: used; Temperature Coefficient: ±100ppm/°C; Category: Resistors; Package / Case: 0402 (1005 Metric); Tolerance: ±1%; .Checked SCH: used; Supplier 1: Digi-Key; Supplier Part Number 1: 1276-3431-6-ND; RoHS: RoHS Compliant; Stock 1: 12738811; Pricing 1: 1=0.1, 10=0.021, 100=0.0087, 1000=0.00391, 2500=0.00339, 5000=0.0028 (USD); Composition: Thick Film; Features: Moisture Resistant; Size / Dimension: 0.039" L x 0.020" W (1.00mm x 0.50mm); Packaging: Digi-Reel®; ComponentLink1URL: http://www.samsungsem.com/kr/support/product-search/chip-resistor/RC1005F103CS.jsp; ComponentLink1Description: http://www.samsungsem.com/kr/support/product-search/chip-resistor/RC1005F103CS.jsp; Manufacturer Part Number 1: RC1005F103CS; Part Status: Active; Operating Temperature: -55°C ~ 155°C; Supplier Device Package: 0402; Height - Seated (Max): 0.016" (0.40mm); Failure Rate: -; Description 1: RES SMD 10K OHM 1% 1/16W 0402
R34 = RC2012F104CS: RES SMD 100K OHM 1% 1/8W 0805; Manufacturer 1: Samsung Electro-Mechanics; Power (Watts): 0.125W, 1/8W; Temperature Coefficient: ±100ppm/°C; Manufacturer Part Number 1: RC2012F104CS; RoHS: RoHS Compliant; Stock 1: 106479; Pricing 1: 1=0.1, 10=0.059, 100=0.024, 1000=0.01079, 2500=0.00936 (USD); Packaging: Digi-Reel®; Part Status: Active; Tolerance: ±1%; Composition: Thick Film; Features: Moisture Resistant; Operating Temperature: -55°C ~ 155°C; Package / Case: 0805 (2012 Metric); Supplier Device Package: 0805; Size / Dimension: 0.079" L x 0.049" W (2.00mm x 1.25mm); Height - Seated (Max): 0.026" (0.65mm); Failure Rate: -; ComponentLink1URL: http://www.samsungsem.com/kr/support/product-search/chip-resistor/RC2012F104CS.jsp; ComponentLink1Description: http://www.samsungsem.com/kr/support/product-search/chip-resistor/RC2012F104CS.jsp; Supplier 1: Digi-Key; Supplier Part Number 1: 1276-3512-6-ND; Description 1: RES SMD 100K OHM 1% 1/8W 0805; Category: Resistors
R40 = RMCF0402FT240R: RES TF 240 OHM 1% 0.0625W 0402; Manufacturer: Stackpole Electronics Inc; Resistance (Ohms): 240; Power (Watts): 0.063W, 1/16W; .Checked PCB: used; Temperature Coefficient: ±100ppm/°C; Category: Resistors; Supplier Part Number: RMCF0402FT240RCT-ND; Manufacturer Part Number: RMCF0402FT240R; Package / Case: 0402 (1005 Metric); Price 1k [$]: 0.00384; Tolerance: ±1%; Value: 240R; .Checked SCH: used; Supplier: Digikey; Supplier 1: Digi-Key; Supplier Part Number 1: RMCF0402FT240RCT-ND; RoHS: RoHS Compliant; Stock 1: 39860; Pricing 1: 1=0.04, 10=0.025, 50=0.0138, 100=0.0105, 250=0.0078, 500=0.00576, 1000=0.00384 (USD); Composition: Thick Film; Features: -; Size / Dimension: 0.039" L x 0.020" W (1.00mm x 0.50mm); Height: 0.016" (0.40mm); Number of Terminations: 2; Packaging: Cut Tape (CT); ComponentLink1URL: http://www.seielect.com/Catalog/SEI-RMCF.pdf; ComponentLink1Description: http://www.seielect.com/Catalog/SEI-RMCF.pdf
R50 R51 = CRG0805F4K7: RES SMD 4.7K OHM 1% 1/8W 0805; Manufacturer 1: TE Connectivity Passive Product; Vendor: TE Connectivity; Built_By: EMA_UL_Team; C: Copyright (C) 2015 Accelerated Designs. All rights reserved; Power (Watts): 0.125W, 1/8W; Temperature Coefficient: ±100ppm/°C; .Checked PCB: CHK; Manufacturer_Part_Number: CRG0805F4K7; RefDes: RefDes; Type: DEV; Manufacturer Part Number 1: CRG0805F4K7; RoHS: RoHS Compliant; Stock 1: 28633; Pricing 1: 1=0.1, 10=0.035, 100=0.0143, 1000=0.00641, 2500=0.00557 (USD); Packaging: Cut Tape (CT); Part Status: Active; Tolerance: ±1%; Composition: Thick Film; Features: -; Operating Temperature: -55°C ~ 125°C; Package / Case: 0805 (2012 Metric); Supplier Device Package: 0805; Size / Dimension: 0.079" L x 0.049" W (2.00mm x 1.25mm); Height - Seated (Max): 0.026" (0.65mm); Failure Rate: -; ComponentLink1URL: http://www.te.com/commerce/DocumentDelivery/DDEController?Action=srchrtrv&DocNm=1773204&DocType=DS&DocLang=English; ComponentLink1Description: http://www.te.com/commerce/DocumentDelivery/DDEController?Action=srchrtrv&DocNm=1773204&DocType=DS&DocLang=English; Supplier 1: Digi-Key; Supplier Part Number 1: A106065CT-ND; Description 1: RES SMD 4.7K OHM 1% 1/8W 0805; Category: Resistors; .Checked SCH: CHK
  R50: Value: 4K7
  R51: Value: 4k7
R52 = RC2012F203CS: RES SMD 20K OHM 1% 1/8W 0805; Manufacturer 1: Samsung Electro-Mechanics; Power (Watts): 0.125W, 1/8W; Temperature Coefficient: ±100ppm/°C; Manufacturer Part Number 1: RC2012F203CS; RoHS: RoHS Compliant; Stock 1: 45533; Pricing 1: 1=0.1, 10=0.059, 100=0.024, 1000=0.01079, 2500=0.00936 (USD); Packaging: Digi-Reel®; Part Status: Active; Tolerance: ±1%; Composition: Thick Film; Features: Moisture Resistant; Operating Temperature: -55°C ~ 155°C; Package / Case: 0805 (2012 Metric); Supplier Device Package: 0805; Size / Dimension: 0.079" L x 0.049" W (2.00mm x 1.25mm); Height - Seated (Max): 0.026" (0.65mm); Failure Rate: -; ComponentLink1URL: http://www.samsungsem.com/kr/support/product-search/chip-resistor/RC2012F203CS.jsp; ComponentLink1Description: http://www.samsungsem.com/kr/support/product-search/chip-resistor/RC2012F203CS.jsp; Supplier 1: Digi-Key; Supplier Part Number 1: 1276-5352-6-ND; Description 1: RES SMD 20K OHM 1% 1/8W 0805; Category: Resistors
R53-R56 = RC1005F750CS: RES SMD 75 OHM 1% 1/16W 0402; Manufacturer 1: Samsung Electro-Mechanics; Power (Watts): 0.063W, 1/16W; .Checked PCB: used; Temperature Coefficient: ±100ppm/°C; Category: Resistors; Package / Case: 0402 (1005 Metric); Tolerance: ±1%; .Checked SCH: used; Supplier 1: Digi-Key; Supplier Part Number 1: 1276-3476-6-ND; RoHS: RoHS Compliant; Stock 1: 924150; Pricing 1: 1=0.1, 10=0.021, 100=0.0087, 1000=0.00391, 2500=0.00339, 5000=0.0028 (USD); Composition: Thick Film; Features: Moisture Resistant; Size / Dimension: 0.039" L x 0.020" W (1.00mm x 0.50mm); Packaging: Digi-Reel®; ComponentLink1URL: http://www.samsungsem.com/kr/support/product-search/chip-resistor/RC1005F750CS.jsp; ComponentLink1Description: http://www.samsungsem.com/kr/support/product-search/chip-resistor/RC1005F750CS.jsp; Manufacturer Part Number 1: RC1005F750CS; Part Status: Active; Operating Temperature: -55°C ~ 155°C; Supplier Device Package: 0402; Height - Seated (Max): 0.016" (0.40mm); Failure Rate: -; Description 1: RES SMD 75 OHM 1% 1/16W 0402
R57 R58 R60 R61 = RC1005F222CS: RES SMD 2.2K OHM 1% 1/16W 0402; Manufacturer 1: Samsung Electro-Mechanics; Power (Watts): 0.063W, 1/16W; .Checked PCB: used; Temperature Coefficient: ±100ppm/°C; Category: Resistors; Package / Case: 0402 (1005 Metric); Tolerance: ±1%; .Checked SCH: used; Supplier 1: Digi-Key; Supplier Part Number 1: 1276-4046-6-ND; RoHS: RoHS Compliant; Stock 1: 956467; Pricing 1: 1=0.1, 10=0.021, 100=0.0087, 1000=0.00391, 2500=0.00339, 5000=0.0028 (USD); Composition: Thick Film; Features: Moisture Resistant; Size / Dimension: 0.039" L x 0.020" W (1.00mm x 0.50mm); Packaging: Digi-Reel®; ComponentLink1URL: http://www.samsungsem.com/kr/support/product-search/chip-resistor/RC1005F222CS.jsp; ComponentLink1Description: http://www.samsungsem.com/kr/support/product-search/chip-resistor/RC1005F222CS.jsp; Manufacturer Part Number 1: RC1005F222CS; Part Status: Active; Operating Temperature: -55°C ~ 155°C; Supplier Device Package: 0402; Height - Seated (Max): 0.016" (0.40mm); Failure Rate: -; Description 1: RES SMD 2.2K OHM 1% 1/16W 0402
R59 R62 = RC1005J000CS: RES SMD 0 OHM JUMPER 1/16W 0402; Manufacturer 1: Samsung Electro-Mechanics; Power (Watts): 0.063W, 1/16W; .Checked PCB: used; Category: Resistors; Package / Case: 0402 (1005 Metric); Tolerance: Jumper; .Checked SCH: used; Supplier 1: Digi-Key; Supplier Part Number 1: 1276-3480-6-ND; RoHS: RoHS Compliant; Stock 1: 9624698; Pricing 1: 1=0.1, 10=0.016, 25=0.0116, 50=0.009, 100=0.0066, 250=0.005, 500=0.004, 1000=0.00295, 5000=0.00211 (USD); Composition: Thick Film; Features: Moisture Resistant; Temperature Coefficient: -; Size / Dimension: 0.039" L x 0.020" W (1.00mm x 0.50mm); Packaging: Digi-Reel®; ComponentLink1URL: http://www.samsungsem.com/kr/support/product-search/chip-resistor/RC1005J000CS.jsp; ComponentLink1Description: http://www.samsungsem.com/kr/support/product-search/chip-resistor/RC1005J000CS.jsp; Manufacturer Part Number 1: RC1005J000CS; Part Status: Active; Operating Temperature: -55°C ~ 155°C; Supplier Device Package: 0402; Height - Seated (Max): 0.016" (0.40mm); Failure Rate: -; Description 1: RES SMD 0 OHM JUMPER 1/16W 0402
R?#1 = ERJ-2RKF33R0X: RES SMD 33 OHM 1% 1/10W 0402; Manufacturer 1: Panasonic Electronic Components; .Checked PCB: RF; Power (Watts): 0.1W, 1/10W; Temperature Coefficient: ±100ppm/°C; .Checked SCH: RF; Manufacturer Part Number 1: ERJ-2RKF33R0X; RoHS: RoHS Compliant; Stock 1: 459707; Pricing 1: 1=0.1, 10=0.056, 100=0.0227, 1000=0.01021, 2500=0.00886, 5000=0.00732 (USD); Packaging: Digi-Reel®; Part Status: Active; Tolerance: ±1%; Composition: Thick Film; Features: Automotive AEC-Q200; Operating Temperature: -55°C ~ 155°C; Package / Case: 0402 (1005 Metric); Supplier Device Package: 0402; Size / Dimension: 0.039" L x 0.020" W (1.00mm x 0.50mm); Height - Seated (Max): 0.016" (0.40mm); Failure Rate: -; ComponentLink1URL: https://industrial.panasonic.com/cdbs/www-data/pdf/RDA0000/AOA0000C304.pdf; ComponentLink1Description: https://industrial.panasonic.com/cdbs/www-data/pdf/RDA0000/AOA0000C304.pdf; Supplier 1: Digi-Key; Supplier Part Number 1: P33.0LDKR-ND; Description 1: RES SMD 33 OHM 1% 1/10W 0402; Category: Resistors
R?#2 = RC0402JR-07100RL: RES SMD 100 OHM 5% 1/10W 0402; Manufacturer Part Number: RC0402JR-07100RL; Supplier Part Number: 311-100JRCT-ND
R?#3 = CRGCQ0402J470R: RES 470 OHM 1/16W 5% 0402 SMD; Manufacturer Part Number: CRGCQ0402J470R; Supplier Part Number: A130046CT-ND
T1 = H5007NL: MODULE SINGLE GIGABIT LAN 24SOIC; Manufacturer: PULSE ELECTRONICS CORPORATION; .Checked PCB: MM; Transformer Type: Isolation and Data Interface (Encapsulated); Turns Ratio - Primary:Secondary: 1CT : 1CT; Category: Transformers; Family: Pulse; Manufacturer Part Number: H5007NL; Operating Temperature: 0°C ~ 70°C; Price 1k [$]: 3.25125; Supplier: Digikey; Supplier Part Number: 553-1334-ND; .Checked SCH: MM; Supplier 1: Digi-Key; Supplier Part Number 1: 553-1334-ND; RoHS: RoHS Compliant; Stock 1: 15654; Pricing 1: 1=5.74, 10=5.1, 100=4.08, 250=3.69752, 500=3.50626, 1000=3.25125, 5000=3.162 (USD); Inductance: -; E.T.: -; Mounting Type: Surface Mount; Size / Dimension: 17.53mm L x 12.20mm W; Height - Seated (Max): 5.76mm; ComponentLink1URL: http://ww2.pulseeng.com/products/datasheets/HC500.pdf; ComponentLink1Description: http://ww2.pulseeng.com/products/datasheets/HC500.pdf
U6 U7 U9-U13 U?#4 = BAT54S: DIODE ARRAY SCHOTTKY 30V SOT23; Manufacturer 1: Nexperia USA Inc.; Manufacturer Part Number 1: BAT54S,235; Vendor: STMicroelectronics; Built_By: EMA_UL_Team; C: Copyright (C) 2015 Accelerated Designs. All rights reserved; Diode Configuration: 1 Pair Series Connection; Current - Average Rectified (Io) (per Diode): 200mA (DC); Speed: Small Signal =< 200mA (Io), Any Speed; Manufacturer_Part_Number: BAT54S; RefDes: RefDes; Type: DEV; Value: Value; RoHS: RoHS Compliant; Stock 1: 7609; Pricing 1: 1=0.23, 10=0.186, 100=0.0986, 500=0.0649, 1000=0.04413 (USD); Packaging: Digi-Reel®; Part Status: Active; Diode Type: Schottky; Operating Temperature - Junction: 150°C (Max); Mounting Type: Surface Mount; Package / Case: TO-236-3, SC-59, SOT-23-3; Supplier Device Package: TO-236AB (SOT23); ComponentLink1URL: https://assets.nexperia.com/documents/data-sheet/BAT54_SER.pdf; ComponentLink1Description: https://assets.nexperia.com/documents/data-sheet/BAT54_SER.pdf; Supplier 1: Digi-Key; Supplier Part Number 1: 1727-1868-6-ND; Description 1: DIODE ARRAY SCHOTTKY 30V SOT23; Category: Discrete Semiconductor Products
U8 = SN74LVC244APWR: IC BUF NON-INVERT 3.6V 20TSSOP; Manufacturer: Texas Instruments; Built_By: EMA_UL_Team; C: Copyright (C) 2015 Accelerated Designs. All rights reserved; Logic Type: Buffer, Non-Inverting; Number of Bits per Element: 4; Output Type: 3-State; Current - Output High, Low: 24mA, 24mA; Voltage - Supply: 1.65 V ~ 3.6 V; .Checked PCB: CHK; Vendor: Vendor; Manufacturer_Part_Number: SN74LVC244APWR; RefDes: RefDes; Type: DEV; Value: Value; Manufacturer 1: Texas Instruments; Manufacturer Part Number 1: SN74LVC244APWR; RoHS: RoHS Compliant; Stock 1: 67361; Pricing 1: 1=0.47, 10=0.402, 100=0.2999, 500=0.23566, 1000=0.1821 (USD); Packaging: Digi-Reel®; Part Status: Active; Input Type: -; Operating Temperature: -40°C ~ 125°C (TA); Mounting Type: Surface Mount; Package / Case: 20-TSSOP (0.173", 4.40mm Width); Supplier Device Package: 20-TSSOP; Base Part Number: 74LVC244; ComponentLink1URL: http://www.ti.com/lit/ds/symlink/sn74lvc244a.pdf; ComponentLink1Description: http://www.ti.com/lit/ds/symlink/sn74lvc244a.pdf; Supplier 1: Digi-Key; Supplier Part Number 1: 296-1230-6-ND; Description 1: IC BUF NON-INVERT 3.6V 20TSSOP; Category: Integrated Circuits (ICs); .Checked SCH: CHK
U14 = ST3222: ST Dual RS232 Transceiver; Manufacturer: STMicroelectronics; Number of Drivers/Receivers: 2/2; Duplex: Full; Data Rate: 250kbps; Voltage - Supply: 3 V ~ 3.6 V; .Checked SCH: CHK; Digikey P/N: 497-5845-2-ND; Supplier 1: Digi-Key; Manufacturer Part Number: ST3222BTR; RoHS: RoHS Compliant; Category: Integrated Circuits (ICs); Stock 1: 3074; Pricing 1: 1=1.32, 10=1.183, 100=0.9225, 500=0.76206, 1000=0.60162 (USD); Packaging: Cut Tape (CT); Part Status: Active; Type: Transceiver; Protocol: RS232; Operating Temperature: -40°C ~ 85°C; Mounting Type: Surface Mount; Package / Case: 20-TSSOP (0.173", 4.40mm Width); Supplier Device Package: 20-TSSOP; Base Part Number: ST3222; ComponentLink1URL: http://www.st.com/content/ccc/resource/technical/document/datasheet/a7/2a/91/f8/35/8c/40/de/CD00002292.pdf/files/CD00002292.pdf/jcr:content/translations/en.CD00002292.pdf; ComponentLink1Description: http://www.st.com/content/ccc/resource/technical/document/datasheet/a7/2a/91/f8/35/8c/40/de/CD00002292.pdf/files/CD00002292.pdf/jcr:content/translations/en.CD00002292.pdf; Supplier Part Number 1: 497-5845-1-ND
U16 = SN74LVC1G17DCKR: Manufacturer: Texas Instruments; Built_By: EMA_UL_Team; C: Copyright (C) 2015 Accelerated Designs. All rights reserved; Logic Type: Buffer, Non-Inverting; Number of Bits per Element: 1; Input Type: Schmitt Trigger; Output Type: Push-Pull; Current - Output High, Low: 32mA, 32mA; Voltage - Supply: 1.65 V ~ 5.5 V; Description 1: IC BUF NON-INVERT 5.5V SC70-5; .Checked PCB: CHK; Vendor: Texas Instruments; Manufacturer_Part_Number: SN74LVC1G17DCKR; RefDes: RefDes; Type: DEV; Value: Value; Manufacturer 1: Texas Instruments; Manufacturer Part Number 1: SN74LVC1G17DCKR; RoHS: RoHS Compliant; Stock 1: 206797; Pricing 1: 1=0.43, 10=0.32, 100=0.1996, 500=0.13658, 1000=0.10506 (USD); Packaging: Digi-Reel®; Part Status: Active; Operating Temperature: -40°C ~ 125°C (TA); Mounting Type: Surface Mount; Package / Case: 5-TSSOP, SC-70-5, SOT-353; Supplier Device Package: SC-70-5; Base Part Number: 74LVC1G17; ComponentLink1URL: http://www.ti.com/lit/ds/symlink/sn74lvc1g17.pdf; ComponentLink1Description: http://www.ti.com/lit/ds/symlink/sn74lvc1g17.pdf; Supplier 1: Digi-Key; Supplier Part Number 1: 296-11934-6-ND; Category: Integrated Circuits (ICs); .Checked SCH: CHK
U17 = MAX9406ETM+: IC DVI/HDMI LVL SHIFTR 48TQFN; Manufacturer 1: Maxim Integrated; Type: Level Shifter; Manufacturer Part Number 1: MAX9406ETM+; RoHS: RoHS Compliant; Stock 1: 162; Pricing 1: 1=3.75, 10=3.563, 25=2.94, 50=2.793, 250=2.70752, 500=2.44832 (USD); Packaging: Tube; Part Status: Active; Applications: Base Stations; Mounting Type: Surface Mount; Package / Case: 48-WFQFN Exposed Pad; Supplier Device Package: 48-TQFN (7x7); Base Part Number: MAX9406; ComponentLink1URL: https://datasheets.maximintegrated.com/en/ds/MAX9406.pdf; ComponentLink1Description: https://datasheets.maximintegrated.com/en/ds/MAX9406.pdf; Supplier 1: Digi-Key; Supplier Part Number 1: MAX9406ETM+-ND; Description 1: IC DVI/HDMI LVL SHIFTR 48TQFN; Category: Integrated Circuits (ICs)
U21 U22 = TPD4E05U06DQAR: TVS DIODE 5.5V 14V 10SON; Vendor: Texas Instruments; Built_By: EMA_UL_Team; C: Copyright (C) 2016 Accelerated Designs. All rights reserved; Voltage - Reverse Standoff (Typ): 5.5V (Max); Voltage - Breakdown (Min): 6V; Current - Peak Pulse (10/1000µs): 2.5A (8/20µs); Power - Peak Pulse: 40W; Power Line Protection: Yes; .Checked PCB: CHK; Manufacturer_Part_Number: TPD4E05U06DQAR; RefDes: RefDes; Type: DEV; Value: Value; Manufacturer 1: Texas Instruments; Manufacturer Part Number 1: TPD4E05U06DQAR; RoHS: RoHS Compliant; Stock 1: 74653; Pricing 1: 1=0.66, 10=0.578, 100=0.4433, 500=0.3504, 1000=0.28032 (USD); Packaging: Digi-Reel®; Part Status: Active; Voltage - Clamping (Max) @ Ipp: 14V; Applications: HDMI; Capacitance @ Frequency: -; Operating Temperature: -40°C ~ 125°C (TA); Mounting Type: Surface Mount; Package / Case: 10-UFDFN; Supplier Device Package: 10-USON (2.5x1); Base Part Number: TPD4E05U06; ComponentLink1URL: http://www.ti.com/lit/ds/symlink/tpd4e05u06.pdf; ComponentLink1Description: http://www.ti.com/lit/ds/symlink/tpd4e05u06.pdf; Supplier 1: Digi-Key; Supplier Part Number 1: 296-35765-6-ND; Description 1: TVS DIODE 5.5V 14V 10SON; Category: Circuit Protection; .Checked SCH: CHK